# Altium schematic sheet Cross.SchDoc
size A1; Organization: Protel International P/L; Address1: L3, 12a Rodborough Rd; Address2: Frenchs Forest; Address3: NSW; Address4: Australia 2086
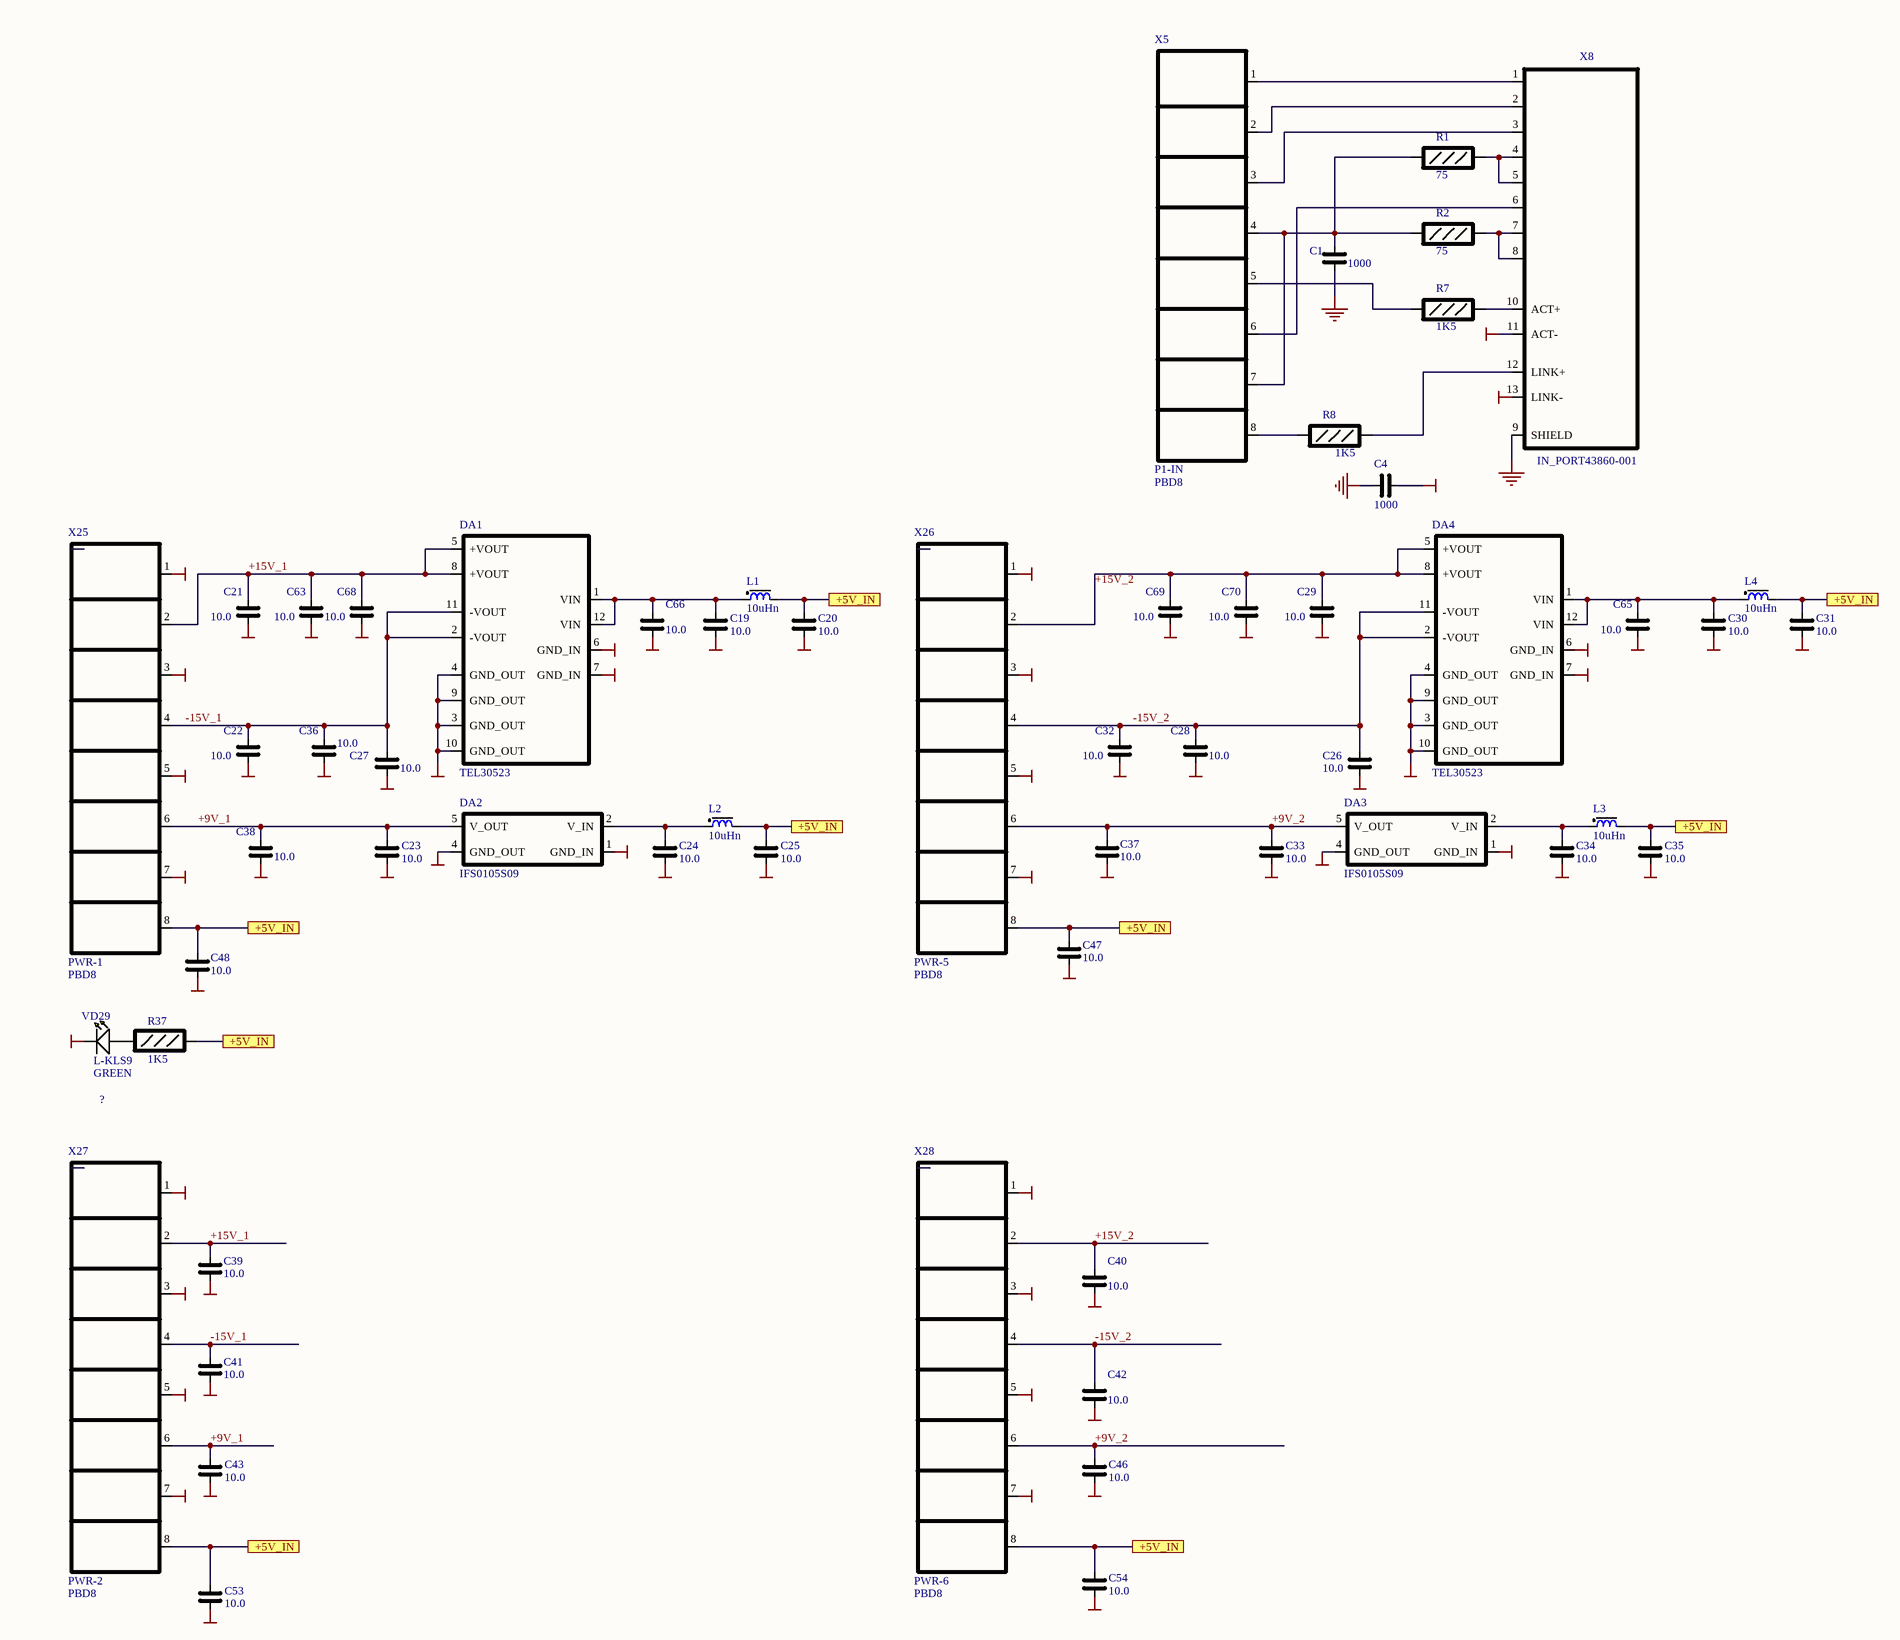
[diagram p0: Cross.SchDoc, top left]
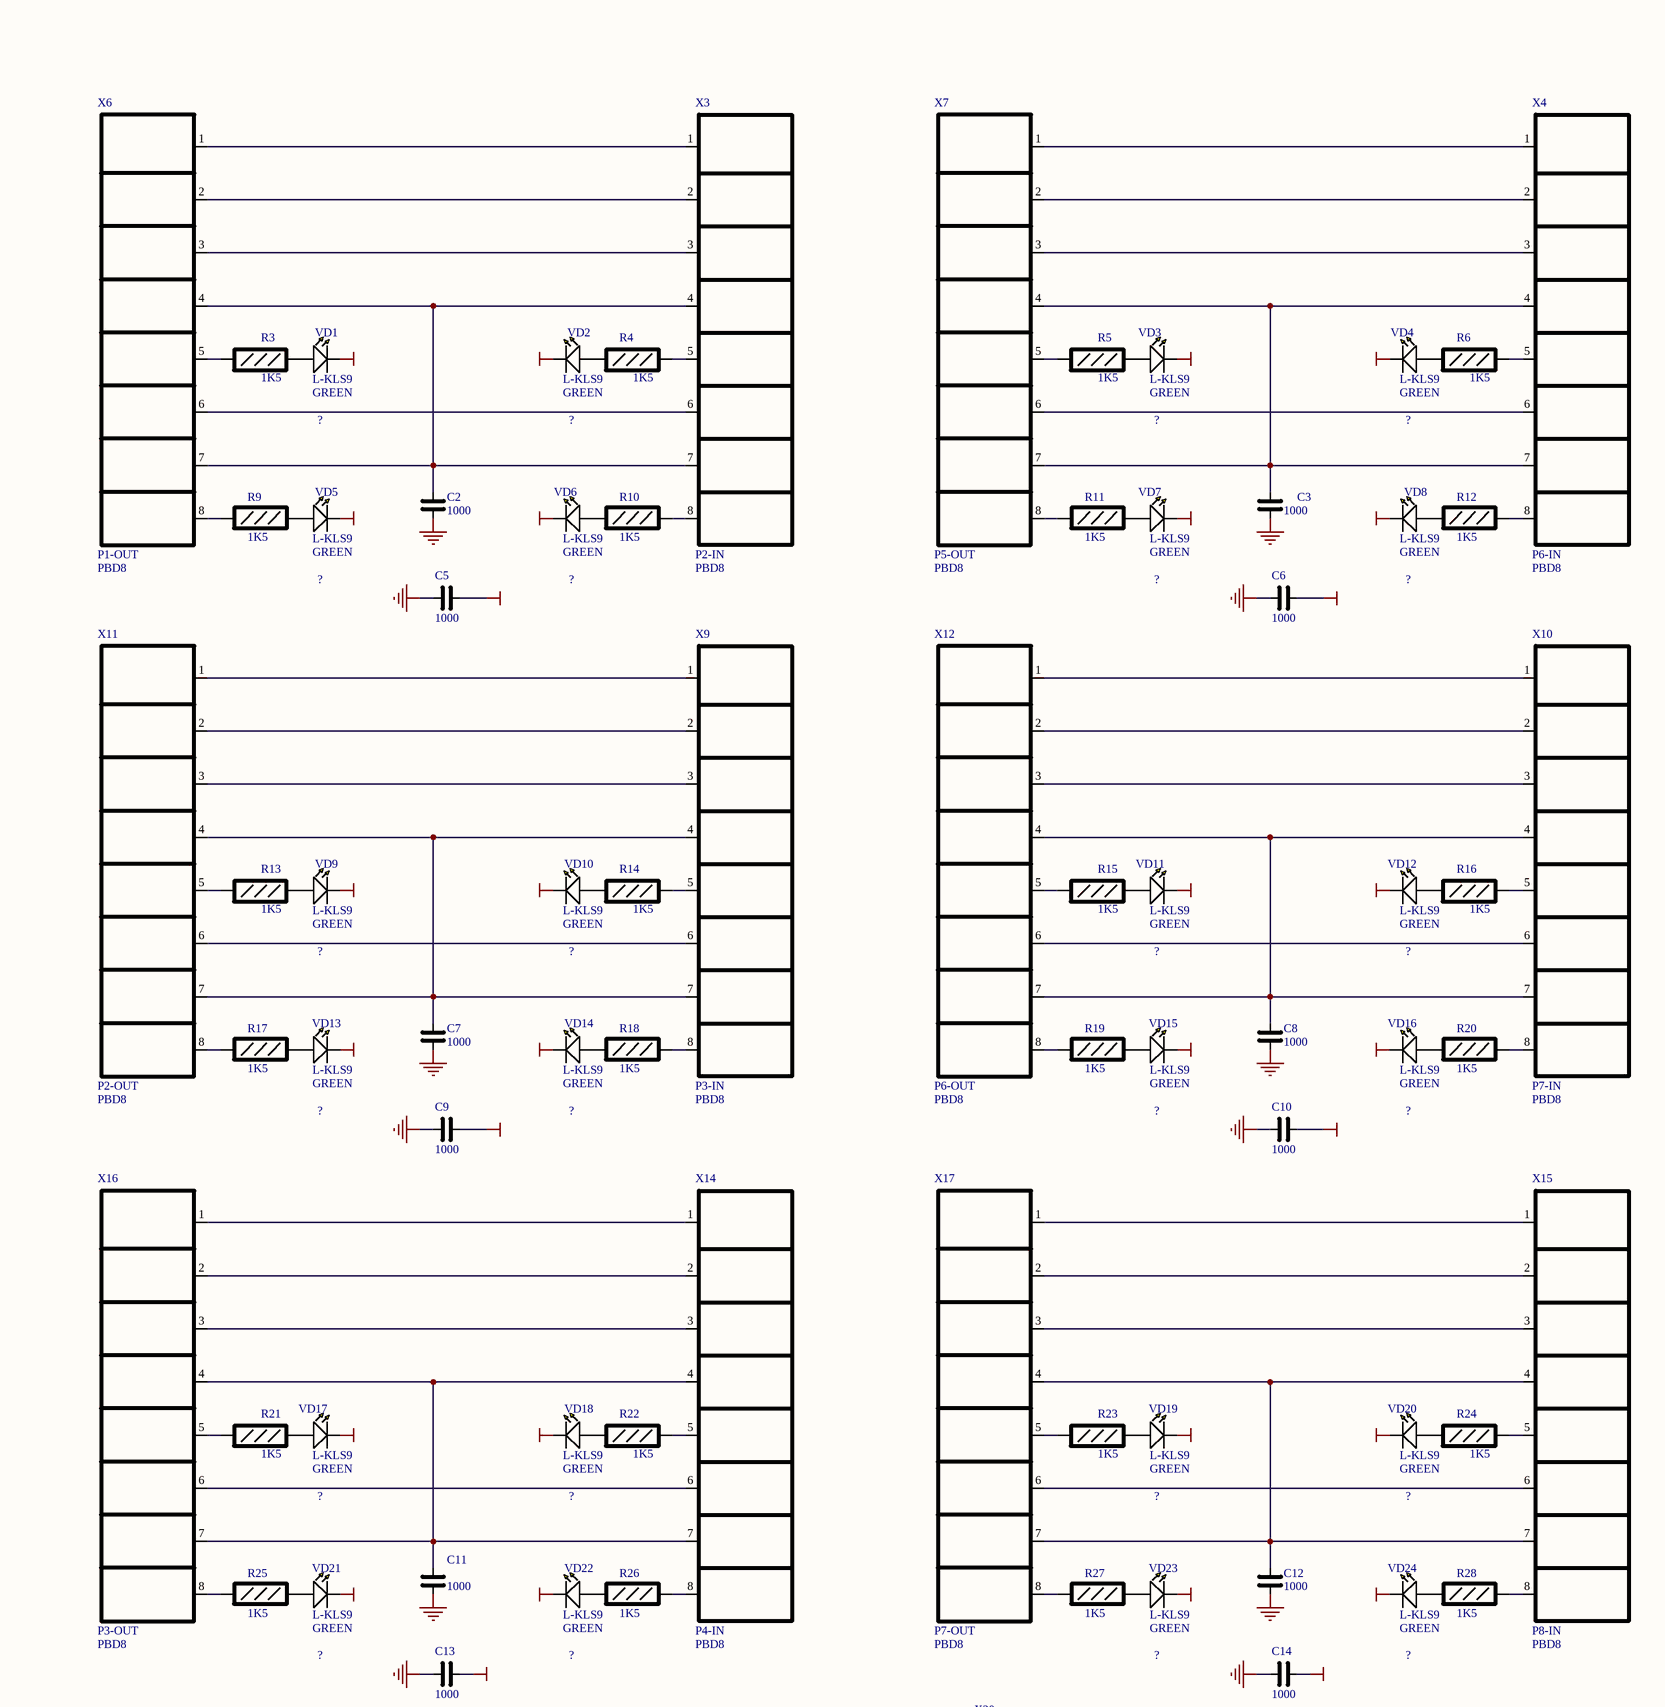
[diagram p1: Cross.SchDoc, top right]
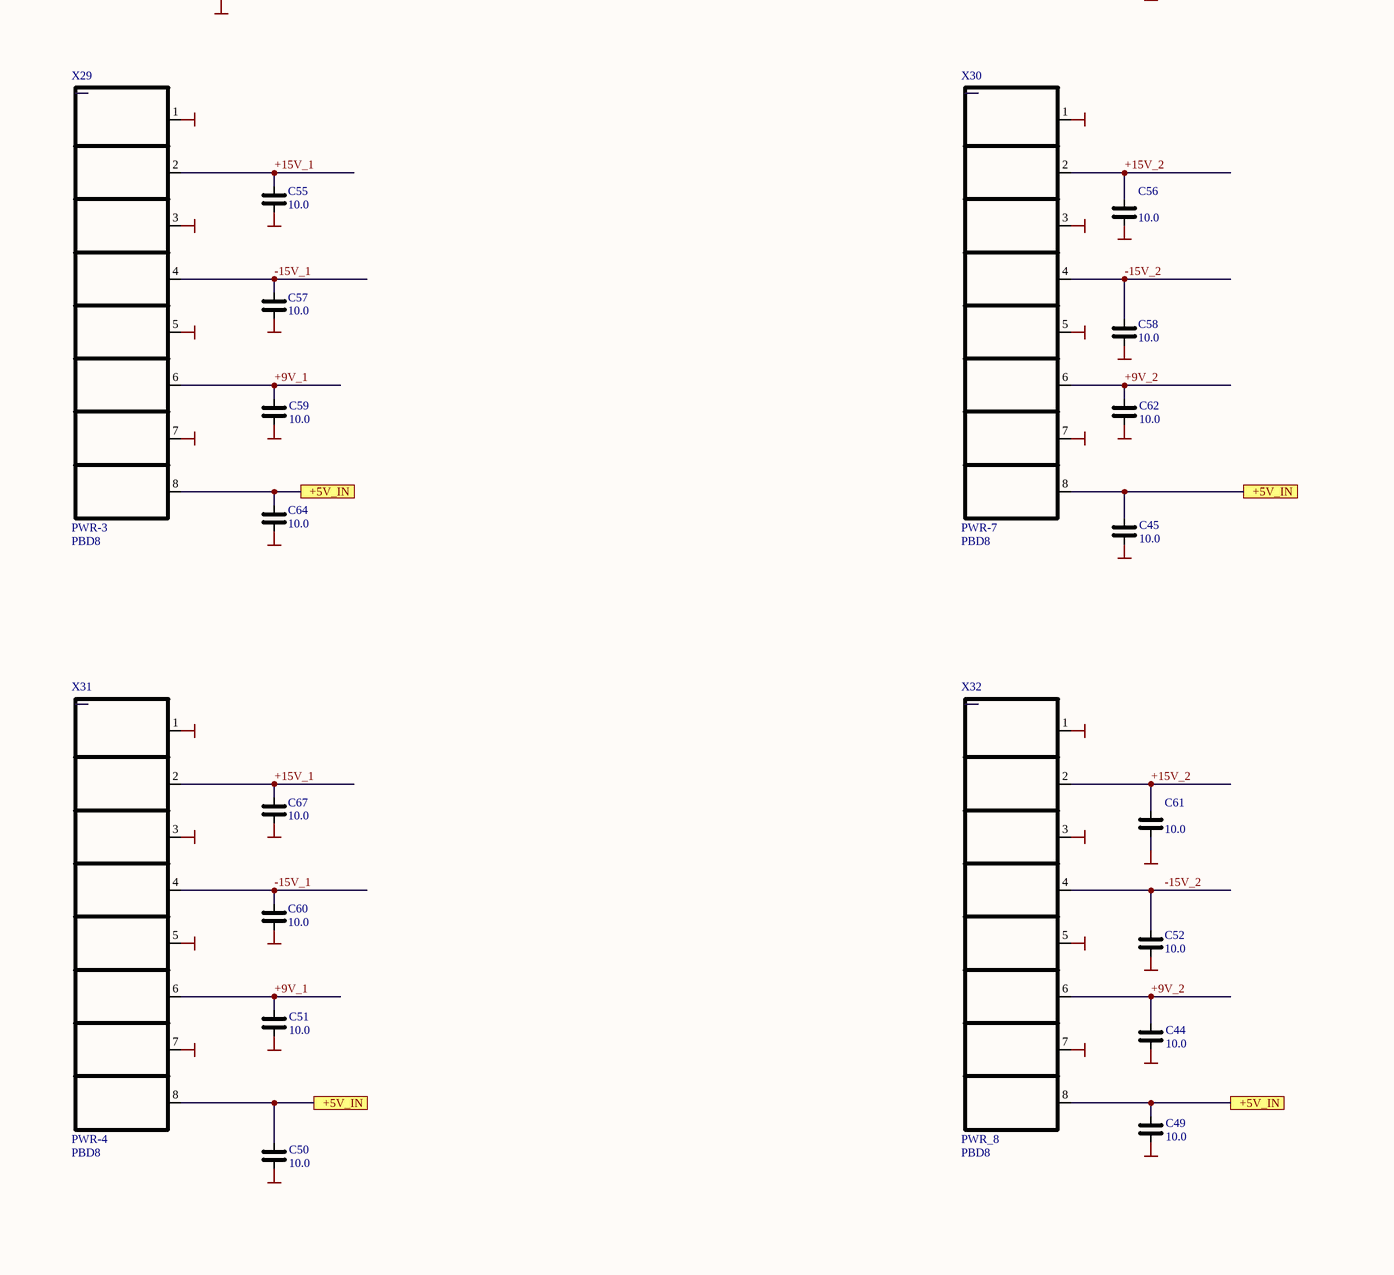
[diagram p2: Cross.SchDoc, bottom left]
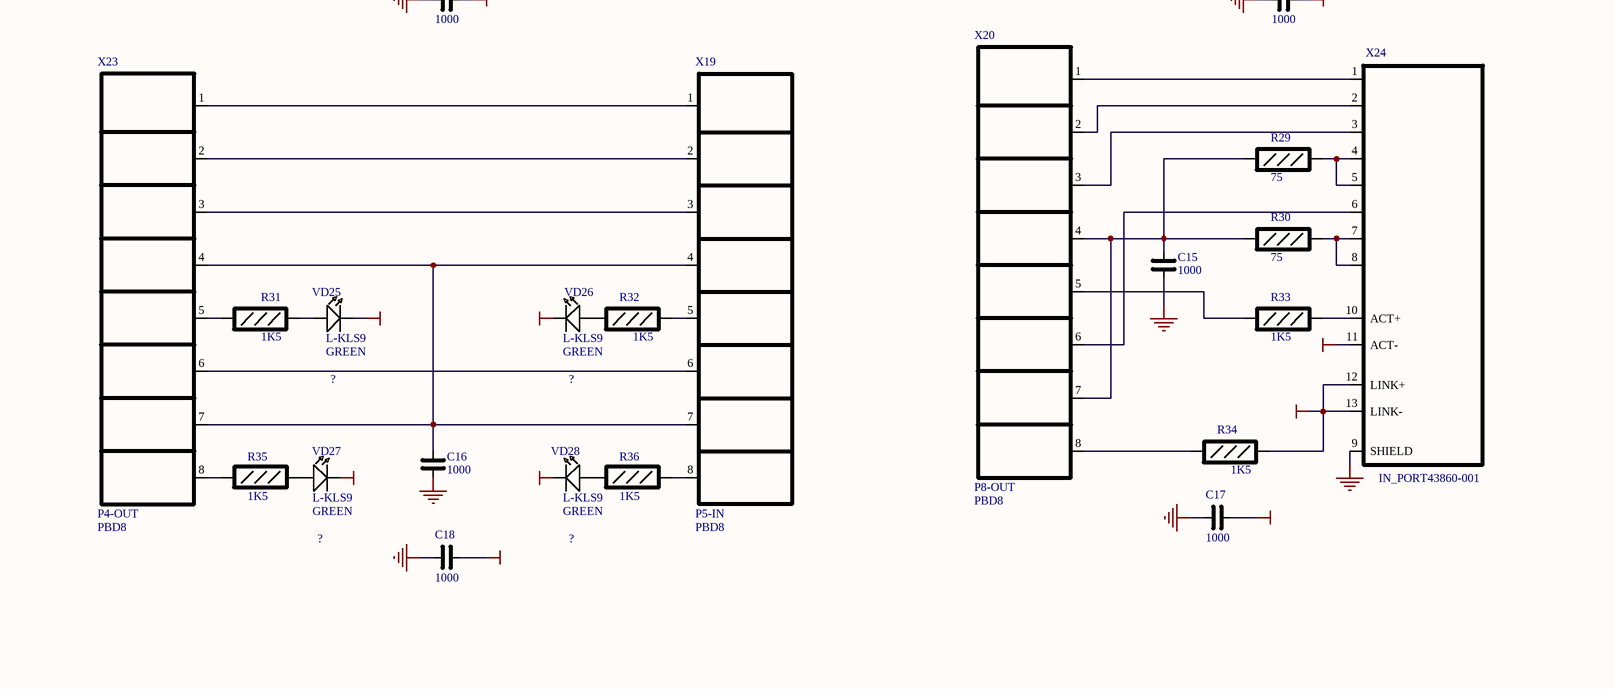
[diagram p3: Cross.SchDoc, bottom right]

## Parts
C1  1000  [CAPC3225X168N]
C2  1000  [CAPC3225X168N]
C3  1000  [CAPC3225X168N]
C4  1000  [CAPC3225X168N]
C5  1000  [CAPC3225X168N]
C6  1000  [CAPC3225X168N]
C7  1000  [CAPC3225X168N]
C8  1000  [CAPC3225X168N]
C9  1000  [CAPC3225X168N]
C10  1000  [CAPC3225X168N]
C11  1000  [CAPC3225X168N]
C12  1000  [CAPC3225X168N]
C13  1000  [CAPC3225X168N]
C14  1000  [CAPC3225X168N]
C15  1000  [CAPC3225X168N]
C16  1000  [CAPC3225X168N]
C17  1000  [CAPC3225X168N]
C18  1000  [CAPC3225X168N]
C19  10.0  [CAPC2012X135N]
C20  10.0  [CAPC2012X135N]
C21  10.0  [CAPC2012X135N]
C22  10.0  [CAPC2012X135N]
C23  10.0  [CAPC2012X135N]
C24  10.0  [CAPC2012X135N]
C25  10.0  [CAPC2012X135N]
C26  10.0  [CAPC2012X135N]
C27  10.0  [CAPC2012X135N]
C28  10.0  [CAPC2012X135N]
C29  10.0  [CAPC2012X135N]
C30  10.0  [CAPC2012X135N]
C31  10.0  [CAPC2012X135N]
C32  10.0  [CAPC2012X135N]
C33  10.0  [CAPC2012X135N]
C34  10.0  [CAPC2012X135N]
C35  10.0  [CAPC2012X135N]
C36  10.0  [CAPC2012X135N]
C37  10.0  [CAPC2012X135N]
C38  10.0  [CAPC2012X135N]
C39  10.0  [CAPC2012X135N]
C40  10.0  [CAPC2012X135N]
C41  10.0  [CAPC2012X135N]
C42  10.0  [CAPC2012X135N]
C43  10.0  [CAPC2012X135N]
C44  10.0  [CAPC2012X135N]
C45  10.0  [CAPC2012X135N]
C46  10.0  [CAPC2012X135N]
C47  10.0  [CAPC2012X135N]
C48  10.0  [CAPC2012X135N]
C49  10.0  [CAPC2012X135N]
C50  10.0  [CAPC2012X135N]
C51  10.0  [CAPC2012X135N]
C52  10.0  [CAPC2012X135N]
C53  10.0  [CAPC2012X135N]
C54  10.0  [CAPC2012X135N]
C55  10.0  [CAPC2012X135N]
C56  10.0  [CAPC2012X135N]
C57  10.0  [CAPC2012X135N]
C58  10.0  [CAPC2012X135N]
C59  10.0  [CAPC2012X135N]
C60  10.0  [CAPC2012X135N]
C61  10.0  [CAPC2012X135N]
C62  10.0  [CAPC2012X135N]
C63  10.0  [CAPC2012X135N]
C64  10.0  [CAPC2012X135N]
C65  10.0  [CAPC2012X135N]
C66  10.0  [CAPC2012X135N]
C67  10.0  [CAPC2012X135N]
C68  10.0  [CAPC2012X135N]
C69  10.0  [CAPC2012X135N]
C70  10.0  [CAPC2012X135N]
DA1  TEL30523  [DIP_12_254_Spec0]
DA2  IFS0105S09  [SOIC_8-254]
DA3  IFS0105S09  [SOIC_8-254]
DA4  TEL30523  [DIP_12_254_Spec0]
L1  10uHn  [SMD2220]
L2  10uHn  [SMD2220]
L3  10uHn  [SMD2220]
L4  10uHn  [SMD2220]
R1  75  [RESC1608X50N]
R2  75  [RESC1608X50N]
R3  1K5  [RESC1608X50N]
R4  1K5  [RESC1608X50N]
R5  1K5  [RESC1608X50N]
R6  1K5  [RESC1608X50N]
R7  1K5  [RESC1608X50N]
R8  1K5  [RESC1608X50N]
R9  1K5  [RESC1608X50N]
R10  1K5  [RESC1608X50N]
R11  1K5  [RESC1608X50N]
R12  1K5  [RESC1608X50N]
R13  1K5  [RESC1608X50N]
R14  1K5  [RESC1608X50N]
R15  1K5  [RESC1608X50N]
R16  1K5  [RESC1608X50N]
R17  1K5  [RESC1608X50N]
R18  1K5  [RESC1608X50N]
R19  1K5  [RESC1608X50N]
R20  1K5  [RESC1608X50N]
R21  1K5  [RESC1608X50N]
R22  1K5  [RESC1608X50N]
R23  1K5  [RESC1608X50N]
R24  1K5  [RESC1608X50N]
R25  1K5  [RESC1608X50N]
R26  1K5  [RESC1608X50N]
R27  1K5  [RESC1608X50N]
R28  1K5  [RESC1608X50N]
R29  75  [RESC1608X50N]
R30  75  [RESC1608X50N]
R31  1K5  [RESC1608X50N]
R32  1K5  [RESC1608X50N]
R33  1K5  [RESC1608X50N]
R34  1K5  [RESC1608X50N]
R35  1K5  [RESC1608X50N]
R36  1K5  [RESC1608X50N]
R37  1K5  [RESC1608X50N]
VD1  ?  Device: L-KLS9  Color: GREEN  [LED0603]
VD2  ?  Device: L-KLS9  Color: GREEN  [LED0603]
VD3  ?  Device: L-KLS9  Color: GREEN  [LED0603]
VD4  ?  Device: L-KLS9  Color: GREEN  [LED0603]
VD5  ?  Device: L-KLS9  Color: GREEN  [LED0603]
VD6  ?  Device: L-KLS9  Color: GREEN  [LED0603]
VD7  ?  Device: L-KLS9  Color: GREEN  [LED0603]
VD8  ?  Device: L-KLS9  Color: GREEN  [LED0603]
VD9  ?  Device: L-KLS9  Color: GREEN  [LED0603]
VD10  ?  Device: L-KLS9  Color: GREEN  [LED0603]
VD11  ?  Device: L-KLS9  Color: GREEN  [LED0603]
VD12  ?  Device: L-KLS9  Color: GREEN  [LED0603]
VD13  ?  Device: L-KLS9  Color: GREEN  [LED0603]
VD14  ?  Device: L-KLS9  Color: GREEN  [LED0603]
VD15  ?  Device: L-KLS9  Color: GREEN  [LED0603]
VD16  ?  Device: L-KLS9  Color: GREEN  [LED0603]
VD17  ?  Device: L-KLS9  Color: GREEN  [LED0603]
VD18  ?  Device: L-KLS9  Color: GREEN  [LED0603]
VD19  ?  Device: L-KLS9  Color: GREEN  [LED0603]
VD20  ?  Device: L-KLS9  Color: GREEN  [LED0603]
VD21  ?  Device: L-KLS9  Color: GREEN  [LED0603]
VD22  ?  Device: L-KLS9  Color: GREEN  [LED0603]
VD23  ?  Device: L-KLS9  Color: GREEN  [LED0603]
VD24  ?  Device: L-KLS9  Color: GREEN  [LED0603]
VD25  ?  Device: L-KLS9  Color: GREEN  [LED0603]
VD26  ?  Device: L-KLS9  Color: GREEN  [LED0603]
VD27  ?  Device: L-KLS9  Color: GREEN  [LED0603]
VD28  ?  Device: L-KLS9  Color: GREEN  [LED0603]
VD29  ?  Device: L-KLS9  Color: GREEN  [LED0603]
X3  P2-IN  [DIP_8-254_F]
X4  P6-IN  [DIP_8-254_F]
X5  P1-IN  [DIP_8-254_F]
X6  P1-OUT  [DIP_8-254_F]
X7  P5-OUT  [DIP_8-254_F]
X8  IN_PORT43860-001  [43860-0010]
X9  P3-IN  [DIP_8-254_F]
X10  P7-IN  [DIP_8-254_F]
X11  P2-OUT  [DIP_8-254_F]
X12  P6-OUT  [DIP_8-254_F]
X14  P4-IN  [DIP_8-254_F]
X15  P8-IN  [DIP_8-254_F]
X16  P3-OUT  [DIP_8-254_F]
X17  P7-OUT  [DIP_8-254_F]
X19  P5-IN  [DIP_8-254_F]
X20  P8-OUT  [DIP_8-254_F]
X23  P4-OUT  [DIP_8-254_F]
X24  IN_PORT43860-001  [43860-0010]
X25  PWR-1  [DIP_8-254_F]
X26  PWR-5  [DIP_8-254_F]
X27  PWR-2  [DIP_8-254_F]
X28  PWR-6  [DIP_8-254_F]
X29  PWR-3  [DIP_8-254_F]
X30  PWR-7  [DIP_8-254_F]
X31  PWR-4  [DIP_8-254_F]
X32  PWR_8  [DIP_8-254_F]

## Ports
+5V_IN

## Nets
eGND: C1.1 C2.1 C3.1 C4.1 C5.1 C6.1 C7.1 C8.1 C9.1 C10.1 C11.1 C12.1 C13.1 C14.1 C15.1 C16.1 C17.1 C18.1 X8.9(SHIELD) X24.9(SHIELD)
GND: C4.2 C5.2 C6.2 C9.2 C10.2 C13.2 C14.2 C17.2 C18.2 C19.1 C20.1 C21.1 C22.1 C23.1 C24.1 C25.1 C26.1 C27.1 C28.1 C29.1 C30.1 C31.1 C32.1 C33.1 C34.1 C35.1 C36.1 C37.1 C38.1 C39.1 C40.1 C41.1 C42.1 C43.1 C44.1 C45.1 C46.1 C47.1 C48.1 C49.1 C50.1 C51.1 C52.1 C53.1 C54.1 C55.1 C56.1 C57.1 C58.1 C59.1 C60.1 C61.1 C62.1 C63.1 C64.1 C65.1 C66.1 C67.1 C68.1 C69.1 C70.1 DA1.3(GND_OUT) DA1.4(GND_OUT) DA1.6(GND_IN) DA1.7(GND_IN) DA1.9(GND_OUT) DA1.10(GND_OUT) DA2.1(GND_IN) DA2.4(GND_OUT) DA3.1(GND_IN) DA3.4(GND_OUT) DA4.3(GND_OUT) DA4.4(GND_OUT) DA4.6(GND_IN) DA4.7(GND_IN) DA4.9(GND_OUT) DA4.10(GND_OUT) R34.2 VD1.1(C) VD2.1(C) VD3.1(C) VD4.1(C) VD5.1(C) VD6.1(C) VD7.1(C) VD8.1(C) VD9.1(C) VD10.1(C) VD11.1(C) VD12.1(C) VD13.1(C) VD14.1(C) VD15.1(C) VD16.1(C) VD17.1(C) VD18.1(C) VD19.1(C) VD20.1(C) VD21.1(C) VD22.1(C) VD23.1(C) VD24.1(C) VD25.1(C) VD26.1(C) VD27.1(C) VD28.1(C) VD29.1(C) X8.11(ACT-) X8.13(LINK-) X24.11(ACT-) X24.12(LINK+) X24.13(LINK-) X25.1 X25.3 X25.5 X25.7 X26.1 X26.3 X26.5 X26.7 X27.1 X27.3 X27.5 X27.7 X28.1 X28.3 X28.5 X28.7 X29.1 X29.3 X29.5 X29.7 X30.1 X30.3 X30.5 X30.7 X31.1 X31.3 X31.5 X31.7 X32.1 X32.3 X32.5 X32.7
+5V_IN: C20.2 C25.2 C31.2 C35.2 C45.2 C47.2 C48.2 C49.2 C50.2 C53.2 C54.2 C64.2 L1.2 L2.2 L3.2 L4.2 R37.1 X25.8 X26.8 X27.8 X28.8 X29.8 X30.8 X31.8 X32.8 ; port +5V_IN
+9V_1: C23.2 C38.2 C43.2 C51.2 C59.2 DA2.5(V_OUT) X25.6 X27.6 X29.6 X31.6
+9V_2: C33.2 C37.2 C44.2 C46.2 C62.2 DA3.5(V_OUT) X26.6 X28.6 X30.6 X32.6
+15V_1: C21.2 C39.2 C55.2 C63.2 C67.2 C68.2 DA1.5(+VOUT) DA1.8(+VOUT) X25.2 X27.2 X29.2 X31.2
+15V_2: C29.2 C40.2 C56.2 C61.2 C69.2 C70.2 DA4.5(+VOUT) DA4.8(+VOUT) X26.2 X28.2 X30.2 X32.2
-15V_1: C22.2 C27.2 C36.2 C41.2 C57.2 C60.2 DA1.2(-VOUT) DA1.11(-VOUT) X25.4 X27.4 X29.4 X31.4
-15V_2: C26.2 C28.2 C32.2 C42.2 C52.2 C58.2 DA4.2(-VOUT) DA4.11(-VOUT) X26.4 X28.4 X30.4 X32.4
NetC1_2: C1.2 R1.1 R2.1 X5.4 X5.7
NetC2_2: C2.2 X3.4 X3.7 X6.4 X6.7
NetC3_2: C3.2 X4.4 X4.7 X7.4 X7.7
NetC7_2: C7.2 X9.4 X9.7 X11.4 X11.7
NetC8_2: C8.2 X10.4 X10.7 X12.4 X12.7
NetC11_2: C11.2 X14.4 X14.7 X16.4 X16.7
NetC12_2: C12.2 X15.4 X15.7 X17.4 X17.7
NetC15_2: C15.2 R29.1 R30.1 X20.4 X20.7
NetC16_2: C16.2 X19.4 X19.7 X23.4 X23.7
NetC19_2: C19.2 C66.2 DA1.1(VIN) DA1.12(VIN) L1.1
NetC24_2: C24.2 DA2.2(V_IN) L2.1
NetC30_2: C30.2 C65.2 DA4.1(VIN) DA4.12(VIN) L4.1
NetC34_2: C34.2 DA3.2(V_IN) L3.1
NetR1_2: R1.2 X8.4(CTT) X8.5(CTR)
NetR2_2: R2.2 X8.7(NC) X8.8(CG)
NetR3_1: R3.1 X6.5
NetR3_2: R3.2 VD1.2(A)
NetR4_1: R4.1 VD2.2(A)
NetR4_2: R4.2 X3.5
NetR5_1: R5.1 X7.5
NetR5_2: R5.2 VD3.2(A)
NetR6_1: R6.1 VD4.2(A)
NetR6_2: R6.2 X4.5
NetR7_1: R7.1 X5.5
NetR7_2: R7.2 X8.10(ACT+)
NetR8_1: R8.1 X5.8
NetR8_2: R8.2 X8.12(LINK+)
NetR9_1: R9.1 VD5.2(A)
NetR9_2: R9.2 X6.8
NetR10_1: R10.1 X3.8
NetR10_2: R10.2 VD6.2(A)
NetR11_1: R11.1 VD7.2(A)
NetR11_2: R11.2 X7.8
NetR12_1: R12.1 X4.8
NetR12_2: R12.2 VD8.2(A)
NetR13_1: R13.1 X11.5
NetR13_2: R13.2 VD9.2(A)
NetR14_1: R14.1 VD10.2(A)
NetR14_2: R14.2 X9.5
NetR15_1: R15.1 X12.5
NetR15_2: R15.2 VD11.2(A)
NetR16_1: R16.1 VD12.2(A)
NetR16_2: R16.2 X10.5
NetR17_1: R17.1 VD13.2(A)
NetR17_2: R17.2 X11.8
NetR18_1: R18.1 X9.8
NetR18_2: R18.2 VD14.2(A)
NetR19_1: R19.1 VD15.2(A)
NetR19_2: R19.2 X12.8
NetR20_1: R20.1 X10.8
NetR20_2: R20.2 VD16.2(A)
NetR21_1: R21.1 X16.5
NetR21_2: R21.2 VD17.2(A)
NetR22_1: R22.1 VD18.2(A)
NetR22_2: R22.2 X14.5
NetR23_1: R23.1 X17.5
NetR23_2: R23.2 VD19.2(A)
NetR24_1: R24.1 VD20.2(A)
NetR24_2: R24.2 X15.5
NetR25_1: R25.1 VD21.2(A)
NetR25_2: R25.2 X16.8
NetR26_1: R26.1 X14.8
NetR26_2: R26.2 VD22.2(A)
NetR27_1: R27.1 VD23.2(A)
NetR27_2: R27.2 X17.8
NetR28_1: R28.1 X15.8
NetR28_2: R28.2 VD24.2(A)
NetR29_2: R29.2 X24.4(CTT) X24.5(CTR)
NetR30_2: R30.2 X24.7(NC) X24.8(CG)
NetR31_1: R31.1 X23.5
NetR31_2: R31.2 VD25.2(A)
NetR32_1: R32.1 VD26.2(A)
NetR32_2: R32.2 X19.5
NetR33_1: R33.1 X20.5
NetR33_2: R33.2 X24.10(ACT+)
NetR34_1: R34.1 X20.8
NetR35_1: R35.1 VD27.2(A)
NetR35_2: R35.2 X23.8
NetR36_1: R36.1 X19.8
NetR36_2: R36.2 VD28.2(A)
NetR37_2: R37.2 VD29.2(A)
NetX3_1: X3.1 X6.1
NetX3_2: X3.2 X6.2
NetX3_3: X3.3 X6.3
NetX3_6: X3.6 X6.6
NetX4_1: X4.1 X7.1
NetX4_2: X4.2 X7.2
NetX4_3: X4.3 X7.3
NetX4_6: X4.6 X7.6
NetX5_1: X5.1 X8.1(TX+)
NetX5_2: X5.2 X8.2(TX-)
NetX5_3: X5.3 X8.3(RX+)
NetX5_6: X5.6 X8.6(RD-)
NetX9_1: X9.1 X11.1
NetX9_2: X9.2 X11.2
NetX9_3: X9.3 X11.3
NetX9_6: X9.6 X11.6
NetX10_1: X10.1 X12.1
NetX10_2: X10.2 X12.2
NetX10_3: X10.3 X12.3
NetX10_6: X10.6 X12.6
NetX14_1: X14.1 X16.1
NetX14_2: X14.2 X16.2
NetX14_3: X14.3 X16.3
NetX14_6: X14.6 X16.6
NetX15_1: X15.1 X17.1
NetX15_2: X15.2 X17.2
NetX15_3: X15.3 X17.3
NetX15_6: X15.6 X17.6
NetX19_1: X19.1 X23.1
NetX19_2: X19.2 X23.2
NetX19_3: X19.3 X23.3
NetX19_6: X19.6 X23.6
NetX20_1: X20.1 X24.1(TX+)
NetX20_2: X20.2 X24.2(TX-)
NetX20_3: X20.3 X24.3(RX+)
NetX20_6: X20.6 X24.6(RD-)

## Notes on the sheet
- Title
- Size:
- Date:
- File:
- A1
- Number:
- Time:
- Revision:
- Sheet
- of

## Library data of the parts
C1-C18 = CAP1210: Chip capasitor 1210; Vendor: Vishay; Unit Price: 0.1; Package: SMD1210; Value: 1000
C19-C70 = CAP0805: Chip capasitor 0805; Vendor: Vishay; Unit Price: 0.1; Package: SMD0805; Value: 10.0
DA1 DA4 = TEL3-: DC/DC convertor Vin to Dual +&- V out; Vendor: TRACO POWER; Device: TEL3; Value: 0523; Unit Price: 30; Package: DIP12Spec
DA2 DA3 = IFS01: DC/DC convertor Vin4.4..5V5 to Single V out; Vendor: XP POWER; Value: 05S09; Device: IFS01; Unit Price: 8; Package: SOIC8-254
L1-L4 = LQN6C: Chip capasitor 1210; Vendor: Epcos; Unit Price: 1; Package: SMD2220; Value: 10uHn
R1-R37 = Res0603: Chip resistor 0603; Group: Passive; Vendor: Vishay; Unit Price: 0.005; Descr: Chip resistor 0603; Package: SMD0603
  R1 R2 R29 R30: Value: 75
  R3-R28 R31-R37: Value: 1K5
VD1-VD29 = L-KLS9-T0603: Chip LED SMD 0603; Vendor: NINGBO KLS ELECTRONIC CO LTD; Value: ?; Package: SMD0603; Unit Price: 0.1
X3-X7 X9-X12 X14-X17 X19 X20 X23 X25-X32 = PBD8: 8 pin TRH socket 2.54mm pitch; Vendor: Connfly; Pckage: DIP8- 2.54; Unit Price: 0.2; Device: PBD8
  X3: Value: P2-IN
  X4: Value: P6-IN
  X5: Value: P1-IN
  X6: Value: P1-OUT
  X7: Value: P5-OUT
  X9: Value: P3-IN
  X10: Value: P7-IN
  X11: Value: P2-OUT
  X12: Value: P6-OUT
  X14: Value: P4-IN
  X15: Value: P8-IN
  X16: Value: P3-OUT
  X17: Value: P7-OUT
  X19: Value: P5-IN
  X20: Value: P8-OUT
  X23: Value: P4-OUT
  X25: Value: PWR-1
  X26: Value: PWR-5
  X27: Value: PWR-2
  X28: Value: PWR-6
  X29: Value: PWR-3
  X30: Value: PWR-7
  X31: Value: PWR-4
  X32: Value: PWR_8
X8 X24 = RG45-43860-0010: RG45 THD Ethernet socket; Vendor: MOLEX; Unit Price: 3; Package: Spec  43860-001; Value: IN_PORT; Device: 43860-001